# EasyEDA Pro project SCH.epro

# Schematic Schematic1
Board Name: Board1; Create Date: 2026-06-20; Page Name: P1; Project Name: DEVBOARD; Schematic Name: Schematic1; Update Date: 2026-06-20; Company: EasyEDA.com; Page Size: A4; Version: V1.0
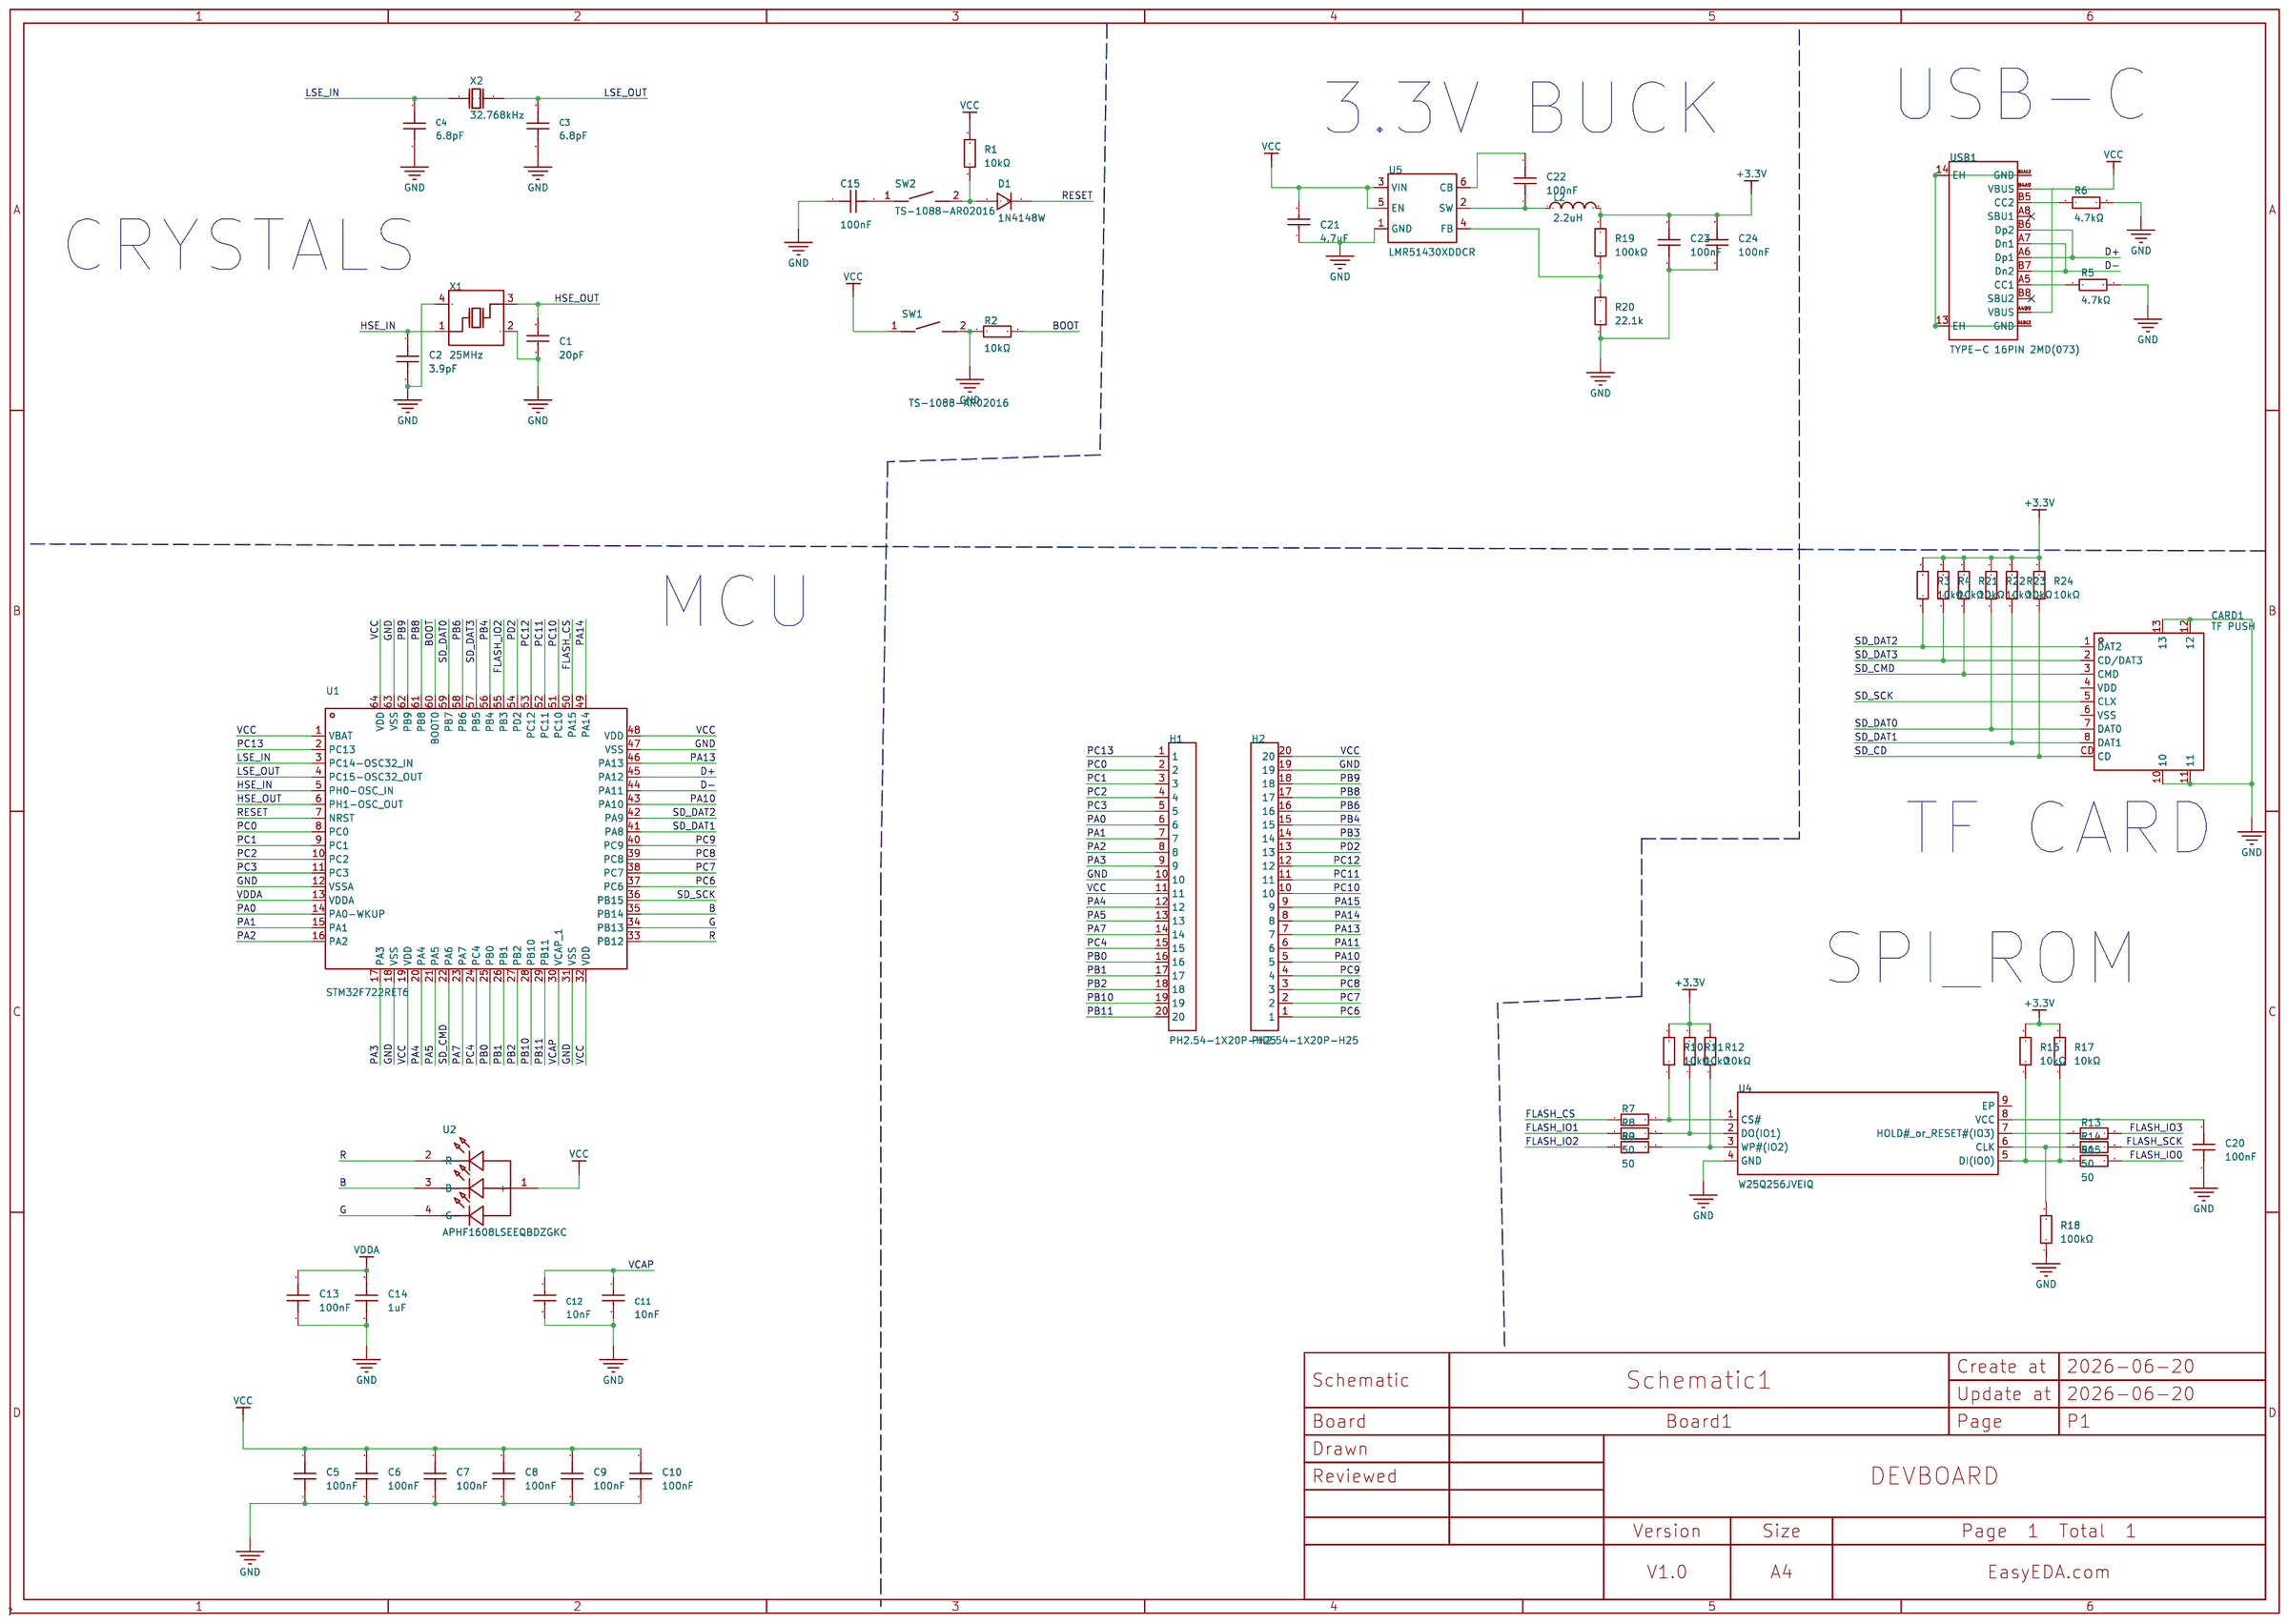
[diagram p0: schematic sheet]

## Parts
C1  20pF  [C0603]
C2  3.9pF  [C0603]
C3  6.8pF  [C0603]
C4  6.8pF  [C0603]
C5  100nF  [C0603]
C6  100nF  [C0603]
C7  100nF  [C0603]
C8  100nF  [C0603]
C9  100nF  [C0603]
C10  100nF  [C0603]
C11  10nF  [C0402]
C12  10nF  [C0402]
C13  100nF  [C0603]
C14  1uF  [C0603]
C15  100nF  [C0603]
C20  100nF  [C0603]
C21  4.7uF  [C0402]
C22  100nF  [C0603]
C23  100nF  [C0603]
C24  100nF  [C0603]
CARD1  TF PUSH  [TF-SMD_TF-PUSH]
D1  1N4148W  [SOD-123_L2.8-W1.8-LS3.7-RD]
H1  PH2.54-1X20P-H25  [HDR-TH_20P-P2.54-V-M_4]
H2  PH2.54-1X20P-H25  [HDR-TH_20P-P2.54-V-M_4]
L2  2.2uH  [IND-SMD_L4.0-W4.0_LQH44PN2R2MP0L]
R1  10kΩ  [R0603]
R2  10kΩ  [R0603]
R3  10kΩ  [R0603]
R4  10kΩ  [R0603]
R5  4.7kΩ  [R0603]
R6  4.7kΩ  [R0603]
R7  50  [R0603]
R8  50  [R0603]
R9  50  [R0603]
R10  10kΩ  [R0603]
R11  10kΩ  [R0603]
R12  10kΩ  [R0603]
R13  50  [R0603]
R14  50  [R0603]
R15  50  [R0603]
R16  10kΩ  [R0603]
R17  10kΩ  [R0603]
R18  100kΩ  [R0603]
R19  100kΩ  [R0603]
R20  22.1k  [R0603]
R21  10kΩ  [R0603]
R22  10kΩ  [R0603]
R23  10kΩ  [R0603]
R24  10kΩ  [R0603]
SW1  TS-1088-AR02016  [SW-SMD_L3.9-W3.0-P4.45]
SW2  TS-1088-AR02016  [SW-SMD_L3.9-W3.0-P4.45]
U1  STM32F722RET6  [LQFP-64_L10.0-W10.0-P0.50-LS12.0-BL]
U2  APHF1608LSEEQBDZGKC  [LED-SMD_4P-L1.6-W0.8_APHF1608LSEEQBDZGKC]
U4  W25Q256JVEIQ  [WSON-8_L8.0-W6.10-P1.27-BL-EP]
U5  LMR51430XDDCR  [SOT-23-6_L2.9-W1.6-P0.95-LS2.8-BL]
USB1  TYPE-C 16PIN 2MD(073)  [USB-C-SMD_TYPE-C-16PIN-2MD-073]
X1  25MHz  [CRYSTAL-SMD_4P-L3.2-W2.5-BL]
X2  32.768kHz  [OSC-SMD_2P-L1.6-W1.0]

## Library data of the parts
C1 = CL10C200JB8NNNC: Capacitance:20pF Tolerance:±5% Tolerance:±5% Voltage Rating:50V Temperature Coefficient:C0G; LCSC Part Name: 20pF ±5% 50V; Supplier Part: C1648; Manufacturer: SAMSUNG(三星); Supplier Footprint: 0603; JLCPCB Part Class: Basic Part; Datasheet: https://item.szlcsc.com/datasheet/CL10C200JB8NNNC/2000.html; Supplier: LCSC; Tolerance: ±5%; Voltage Rating: 50V; Temperature Coefficient: C0G
C2 = CAP_0603: Supplier Footprint: 0603
C3 C4 = 6.8pF: Capacitance: Voltage Rated: Temperature Coefficient:; LCSC Part Name: 6.8pF 50V; Supplier Part: C15720; Manufacturer: SAMSUNG(三星); Supplier Footprint: 0603; JLCPCB Part Class: Extended Part; Datasheet: https://atta.szlcsc.com/upload/public/pdf/source/20160218/1457707763339.pdf; Supplier: LCSC
C5-C10 C13 C15 C20 C22-C24 = CC0603KRX7R9BB104: Capacitance:100nF Tolerance:±10% Tolerance:±10% Voltage Rating:50V Temperature Coefficient:X7R; LCSC Part Name: 100nF ±10% 50V; Supplier Part: C14663; Manufacturer: YAGEO(国巨); Supplier Footprint: 0603; JLCPCB Part Class: Basic Part; Datasheet: https://item.szlcsc.com/datasheet/CC0603KRX7R9BB104/15331.html; Supplier: LCSC; Tolerance: ±10%; Voltage Rating: 50V; Temperature Coefficient: X7R
C11 C12 = 0402B103K500NT: Capacitance:10nF Tolerance:±10% Tolerance:±10% Voltage Rating:50V Temperature Coefficient:X7R; LCSC Part Name: 10nF ±10% 50V; Supplier Part: C1524; Manufacturer: FH(风华); Supplier Footprint: 0402; JLCPCB Part Class: Extended Part; Datasheet: https://item.szlcsc.com/datasheet/0402B103K500NT/1876.html; Supplier: LCSC; Tolerance: ±10%; Voltage Rating: 50V; Temperature Coefficient: X7R
C14 = CL10A105KB8NNNC: Capacitance:1uF Tolerance:±10% Tolerance:±10% Voltage Rating:50V Temperature Coefficient:X5R; LCSC Part Name: 1uF ±10% 50V; Supplier Part: C15849; Manufacturer: SAMSUNG(三星); Supplier Footprint: 0603; JLCPCB Part Class: Basic Part; Datasheet: https://item.szlcsc.com/datasheet/CL10A105KB8NNNC/16531.html; Supplier: LCSC; Tolerance: ±10%; Voltage Rating: 50V; Temperature Coefficient: X5R
C21 = GRM155R61A475KEAAD: Capacitance:4.7uF Tolerance:±10% Tolerance:±10% Voltage Rating:10V Temperature Coefficient:X5R; LCSC Part Name: 4.7uF ±10% 10V; Supplier Part: C77004; Manufacturer: muRata(村田); Supplier Footprint: 0402; JLCPCB Part Class: Extended Part; Datasheet: https://item.szlcsc.com/datasheet/GRM155R61A475KEAAD/78131.html; Supplier: LCSC; Tolerance: ±10%; Voltage Rating: 10V; Temperature Coefficient: X5R
CARD1 = TF PUSH: Card Connection Mode:Push-Push Card Type:MicroSD Card (TF Card) Connector Type:Connector and Ejector Additional Card Detection Pins:No Supplementary Features:- Height Above Board:2mm Operating Temperature:-25℃~+90℃ Operating Temperature:-25℃~+90℃; LCSC Part Name: 9P，自弹式TF卡座; Supplier Part: C393941; Manufacturer: SHOU HAN(首韩); Supplier Footprint: SMD; JLCPCB Part Class: Extended Part; Datasheet: https://item.szlcsc.com/datasheet/TF%2520PUSH/372553.html; Supplier: LCSC; Card Connection Mode: Push-Push; Card Type: MicroSD Card (TF Card); Connector Type: Connector and Ejector; Additional Card Detection Pins: No; Height Above Board: 2mm; Operating Temperature: -25℃~+90℃
D1 = 1N4148W_C176288: Diode Configuration:Independent Voltage - Forward(Vf@If):1.25V@150mA Voltage - DC Reverse(Vr):75V Current - Rectified:150mA Pd - Power Dissipation:400mW Reverse Leakage Current (Ir):2.5uA@75V Reverse Recovery Time (trr):4ns Operating Junction Temperature; Supplier Part: C176288; Manufacturer: SMC(桑德斯); Supplier Footprint: SOD-123; JLCPCB Part Class: Extended Part; Datasheet: https://item.szlcsc.com/datasheet/1N4148W/187678.html; Supplier: LCSC; Diode Configuration: Independent; Voltage - Forward(Vf@If): 1.25V@150mA; Voltage - DC Reverse(Vr): 75V; Current - Rectified: 150mA; Pd - Power Dissipation: 400mW; Reverse Leakage Current (Ir): 2.5uA@75V; Reverse Recovery Time (trr): 4ns; Operating Junction Temperature Range: -55℃~+125℃@(Tj); Non-Repetitive Peak Forward Surge Current: 2A
H1 H2 = PH2.54-1X20P-H25: Pin Structure:1x20P Pitch:2.54mm Row Spacing:- Circluar Pins/Square Pins:Pin Header Mounting Type:Through Hole Number of Rows:1 Number of Pins:20P Current Rating:3A Voltage Rating (Max):- Length of Mating Pin:6mm Insulation Height:2.5mm Length of End Conn; LCSC Part Name: 1x20P 间距:2.54mm 方针 直插; Supplier Part: C42431804; Manufacturer: JXTCONN(聚兴泰); Supplier Footprint: 插件,P=2.54mm; JLCPCB Part Class: Extended Part; Datasheet: https://item.szlcsc.com/datasheet/PH2.54-1X20P-H25/44458934.html; Supplier: LCSC; Pin Structure: 1x20P; Pitch: 2.54mm; Circluar Pins/Square Pins: Pin Header; Mounting Type: Through Hole; Number of Rows: 1; Number of Pins: 20P; Current Rating: 3A; Length of Mating Pin: 6mm; Insulation Height: 2.5mm; Length of End Connection Pin: 3mm; Contact Material: Brass; Contact Plating: Gold; Operating Temperature: -40℃~+105℃; Color: Black
L2 = SMNR4020-2.2UH: Inductance:2.2uH Tolerance:±20% Tolerance:±20% Current Rating:3.4A Current - Saturation(Isat):3.4A DC Resistance(DCR):46mΩ; LCSC Part Name: 2.2uH ±20% 3.4A; Supplier Part: C135262; Manufacturer: SXN(顺翔诺); Supplier Footprint: SMD,4x4mm; JLCPCB Part Class: Extended Part; Datasheet: https://item.szlcsc.com/datasheet/SMNR4020-2.2UH/146573.html; Supplier: LCSC; Tolerance: ±20%; Current Rating: 3.4A; Current - Saturation(Isat): 3.4A; DC Resistance(DCR): 46mΩ
R1-R4 R10-R12 R16 R17 R21-R24 = RC0603FR-0710KL: Type:Thick Film Resistor Resistance:10kΩ Tolerance:±1% Tolerance:±1% Power(Watts):100mW Voltage-Supply(Max):75V Temperature Coefficient:±100ppm/℃ Temperature Coefficient:±100ppm/℃ Operating Temperature:-55℃~+155℃ Operating Temperature:-55℃~+155℃; LCSC Part Name: 厚膜电阻 10kΩ ±1% 100mW; Supplier Part: C98220; Manufacturer: YAGEO(国巨); Supplier Footprint: 0603; JLCPCB Part Class: Extended Part; Datasheet: https://item.szlcsc.com/datasheet/RC0603FR-0710KL/99429.html; Supplier: LCSC; Type: Thick Film Resistor; Tolerance: ±1%; Power(Watts): 100mW; Voltage-Supply(Max): 75V; Temperature Coefficient: ±100ppm/℃; Operating Temperature: -55℃~+155℃
R5 R6 = 0603WAF4701T5E: Type:Thick Film Resistor Resistance:4.7kΩ Tolerance:±1% Tolerance:±1% Power(Watts):100mW Voltage-Supply(Max):75V Temperature Coefficient:±100ppm/℃ Temperature Coefficient:±100ppm/℃ Operating Temperature:-55℃~+155℃ Operating Temperature:-55℃~+155℃; LCSC Part Name: 4.7kΩ ±1% 100mW 厚膜电阻; Supplier Part: C23162; Manufacturer: UNI-ROYAL(厚声); Supplier Footprint: 0603; JLCPCB Part Class: Basic Part; Datasheet: https://item.szlcsc.com/datasheet/0603WAF4701T5E/23889.html; Supplier: LCSC; Type: Thick Film Resistor; Tolerance: ±1%; Power(Watts): 100mW; Voltage-Supply(Max): 75V; Temperature Coefficient: ±100ppm/℃; Operating Temperature: -55℃~+155℃
R7-R9 R13-R15 = Res_0603: Supplier Footprint: 0603
R18 R19 = 0603WAF1003T5E: Type:Thick Film Resistor Resistance:100kΩ Tolerance:±1% Tolerance:±1% Power(Watts):100mW Voltage-Supply(Max):75V Temperature Coefficient:±100ppm/℃ Temperature Coefficient:±100ppm/℃ Operating Temperature:-55℃~+155℃ Operating Temperature:-55℃~+155℃; LCSC Part Name: 100kΩ ±1% 100mW 厚膜电阻; Supplier Part: C25803; Manufacturer: UNI-ROYAL(厚声); Supplier Footprint: 0603; JLCPCB Part Class: Basic Part; Datasheet: https://item.szlcsc.com/datasheet/0603WAF1003T5E/26546.html; Supplier: LCSC; Type: Thick Film Resistor; Tolerance: ±1%; Power(Watts): 100mW; Voltage-Supply(Max): 75V; Temperature Coefficient: ±100ppm/℃; Operating Temperature: -55℃~+155℃
R20 = Res_0603: Supplier Footprint: 0603; Supplier: LCSC; Supplier Part: C269476; Manufacturer: Tyohm(幸亚电阻); Manufacturer Part: RMC060322.1K1%N; JLCPCB Part Class: Extended Part; LCSC Part Name: 厚膜电阻 22.1kΩ ±1% 100mW; Datasheet: https://item.szlcsc.com/datasheet/RMC060322.1K1%2525N/258916.html; Type: Thick Film Resistor; Tolerance: ±1%; Power(Watts): 100mW; Voltage-Supply(Max): 50V; Temperature Coefficient: ±100ppm/℃; Operating Temperature: -55℃~+155℃
SW1 SW2 = TS-1088-AR02016: Circuit:SPST Actuator Style:Round Button Operating Force:1.6N Mounting Type:Surface Mount,Vertical Length:4mm Width:3mm Switch Height:2mm with Bracket:Without Bracket Contact Current:50mA Voltage Rating:12V Actuator/Cap Color:Black Termination Style:SMD(S; LCSC Part Name: 4*3*2mm 立贴 轻触开关; Supplier Part: C720477; Manufacturer: XUNPU(讯普); Supplier Footprint: SMD,4x3mm; JLCPCB Part Class: Basic Part; Datasheet: https://item.szlcsc.com/datasheet/TS-1088-AR02016/763484.html; Supplier: LCSC; Circuit: SPST; Actuator Style: Round Button; Operating Force: 1.6N; Mounting Type: Surface Mount,Vertical; Length: 4mm; Width: 3mm; Switch Height: 2mm; with Bracket: Without Bracket; Contact Current: 50mA; Voltage Rating: 12V; Actuator/Cap Color: Black; Termination Style: SMD(SMT) Tab; Life: 100,000 Cycles; Operating Temperature: -30℃~+80℃
U1 = STM32F722RET6: CPU Core:ARM Cortex-M Series CPU Maximum Speed:216MHz Program Storage Size:512KB Program Memory Type:FLASH Number of I/O:50 ADC (Bit):12bit DAC (Bit):12bit Voltage - Supply:1.7V~3.6V Voltage - Supply:1.7V~3.6V Applications:-; LCSC Part Name: 带DSP和FPU的高性能ARM Cortex-M7 MCU，具有512 KB Flash、216 MHz CPU、ART加速器、一级缓存和SDRAM; Supplier Part: C118207; Manufacturer: ST(意法半导体); Supplier Footprint: LQFP-64(10x10); JLCPCB Part Class: Extended Part; Datasheet: https://item.szlcsc.com/datasheet/STM32F722RET6/119471.html; Supplier: LCSC; CPU Core: ARM Cortex-M Series; CPU Maximum Speed: 216MHz; Program Storage Size: 512KB; Program Memory Type: FLASH; Number of I/O: 50; ADC (Bit): 12bit; DAC (Bit): 12bit; Voltage - Supply: 1.7V~3.6V
U2 = APHF1608LSEEQBDZGKC: Diode Configuration:Common Anode Wavelength - Dominant:B:465nm；G:525nm；R:621nm Peak Wavelength:B:460nm；R:630nm；G:515nm Luminous Intensity:G:90mcd；B:10mcd；R:15mcd Viewing Angle:140° Lens Color:Water Clear Forward Current:R:30mA；B:20mA；G:20mA Forward Voltag; LCSC Part Name: 1.6 x 0.8 mm全彩贴片式LED; Supplier Part: C3019171; Manufacturer: Kingbright; Supplier Footprint: SMD-4P,1.6x0.8mm; JLCPCB Part Class: Extended Part; Datasheet: https://item.szlcsc.com/datasheet/APHF1608LSEEQBDZGKC/3535847.html; Supplier: LCSC; Diode Configuration: Common Anode; Wavelength - Dominant: B:465nm；G:525nm；R:621nm; Peak Wavelength: B:460nm；R:630nm；G:515nm; Luminous Intensity: G:90mcd；B:10mcd；R:15mcd; Viewing Angle: 140°; Lens Color: Water Clear; Forward Current: R:30mA；B:20mA；G:20mA; Forward Voltage(Vf): G:2.65V~3.1V；B:2.65V~3.1V；R:1.8V~2.1V; Antistatic Capacity: R:3000V；B:250V；G:450V; Power(Watts): B:80mW；G:82mW；R:75mW; Operating Temperature: -40℃~+85℃; Length: 1.6mm; Width: 0.8mm; Height: 0.5mm
U4 = W25Q256JVEIQ_C97522: Interface:SPI Memory Size:256Mbit Clock Frequency:133MHz Voltage - Supply:2.7V~3.6V Voltage - Supply:2.7V~3.6V Program / Erase Cycles:100,000 Cycles Page Programming Time (Tpp):700us Block Erase Time(tBE):120ms@(32KB) Data Retention - TDR (Year):20 Years; LCSC Part Name: 具备双/四SPI接口的3V、256Mbit 串行闪存; Supplier Part: C97522; Manufacturer: Winbond(华邦); Supplier Footprint: WSON-8-EP(6x8); JLCPCB Part Class: Extended Part; Datasheet: https://item.szlcsc.com/datasheet/W25Q256JVEIQ/98730.html; Supplier: LCSC; Interface: SPI; Memory Size: 256Mbit; Clock Frequency: 133MHz; Voltage - Supply: 2.7V~3.6V; Program / Erase Cycles: 100,000 Cycles; Page Programming Time (Tpp): 700us; Block Erase Time(tBE): 120ms@(32KB); Data Retention - TDR (Year): 20 Years; Operating Temperature: -40℃~+85℃
U5 = LMR51430XDDCR: Function:Step-down type Voltage - Supply:4.5V~36V Voltage - Supply:4.5V~36V Output Voltage:600mV~34.2V Output Voltage:600mV~34.2V Output Current:3A Frequency - Switching:500kHz Frequency - Switching:500kHz Operating Temperature:-40℃~+150℃@(TJ) Operating T; LCSC Part Name: 降压型 3A 4.5V~36V; Supplier Part: C5185863; Manufacturer: TI(德州仪器); Supplier Footprint: SOT-23-6; JLCPCB Part Class: Extended Part; Datasheet: https://item.szlcsc.com/datasheet/LMR51430XDDCR/5856347.html; Supplier: LCSC; Function: Step-down type; Voltage - Supply: 4.5V~36V; Output Voltage: 600mV~34.2V; Output Current: 3A; Frequency - Switching: 500kHz; Operating Temperature: -40℃~+150℃@(TJ); Synchronous Rectifier: Yes; Number of Outputs: 1; Topology: Buck; Quiescent Current: 40uA; Switch tube (built-in/external): Built-in; Output Type: Adjustable; Features: Light load efficient mode；Cycle-by-cycle current limiting；Overcurrent Protection；Hiccup current limiting
USB1 = TYPE-C 16PIN 2MD(073): Connector Type:Type-C Protocol Standard:- Gender:Female Mounting Type:Surface Mount, Right Angle Number of Contacts:16P Number of Ports:1 Current Rating-Power:3A Voltage Rating:5V Connect-Disconnect Life:10,000 Cycles Supplementary Features:- Center Heigh; LCSC Part Name: Type-C 母 卧贴; Supplier Part: C2765186; Manufacturer: SHOU HAN(首韩); Supplier Footprint: SMD; JLCPCB Part Class: Extended Part; Datasheet: https://item.szlcsc.com/datasheet/TYPE-C%252016PIN%25202MD(073)/2901843.html; Supplier: LCSC; Connector Type: Type-C; Gender: Female; Mounting Type: Surface Mount, Right Angle; Number of Contacts: 16P; Number of Ports: 1; Current Rating-Power: 3A; Voltage Rating: 5V; Connect-Disconnect Life: 10,000 Cycles; Detection color: Black; Operating Temperature: -25℃~+85℃
X1 = X322525MOB4SI: Type:Crystal Oscillator Frequency:25MHz Normal temperature Frequency Tolerance:±10ppm Normal temperature Frequency Tolerance:±10ppm Load Capacitance:12pF Frequency Stability:±20ppm Frequency Stability:±20ppm Operating Temperature:-40℃~+85℃ Operating Tempe; LCSC Part Name: YSX321SL 25MHZ 4P 3225 12PF ±10PPM -40~85℃ (±20PPM); Supplier Part: C9006; Manufacturer: YXC(扬兴晶振); Supplier Footprint: SMD3225-4P; JLCPCB Part Class: Basic Part; Datasheet: https://item.szlcsc.com/datasheet/X322525MOB4SI/9526.html; Supplier: LCSC; Type: Crystal Oscillator; Normal temperature Frequency Tolerance: ±10ppm; Load Capacitance: 12pF; Frequency Stability: ±20ppm; Operating Temperature: -40℃~+85℃
X2 = ABS05-32.768kHz-T: Type:- Frequency:32.768kHz Normal temperature Frequency Tolerance:±20ppm Normal temperature Frequency Tolerance:±20ppm Load Capacitance:12.5pF Frequency Stability:- Frequency Stability:- Equivalent Series Resistance(ESR):90kΩ Operating Temperature:-40℃~+8; LCSC Part Name: 32.768kHz ±20ppm 12.5pF; Supplier Part: C179633; Manufacturer: ABRACON; Supplier Footprint: SMD1610-2P; JLCPCB Part Class: Extended Part; Datasheet: https://item.szlcsc.com/datasheet/ABS05-32.768kHz-T/191028.html; Supplier: LCSC; Normal temperature Frequency Tolerance: ±20ppm; Load Capacitance: 12.5pF; Equivalent Series Resistance(ESR): 90kΩ; Operating Temperature: -40℃~+85℃

## Nets
+3.3V: C23.2 C24.2 L2.2 R3.2 R4.2 R10.2 R11.2 R12.2 R16.2 R17.2 R19.2 R21.2 R22.2 R23.2 R24.2
GND: C1.1 C2.2 C3.2 C4.2 C5.1 C6.1 C7.1 C8.1 C9.1 C10.1 C11.1 C12.1 C13.1 C14.1 C15.1 C20.1 C21.1 C23.1 C24.1 CARD1.10 CARD1.11 CARD1.12 CARD1.13 H1.10 H2.19 R2.2 R5.2 R6.2 R18.1 R20.1 SW1.2 U1.12(VSSA) U1.18(VSS) U1.31(VSS) U1.47(VSS) U1.63(VSS) U4.4(GND) U5.1(GND) X1.2(GND) X1.4(GND)
VCC: C5.2 C6.2 C7.2 C8.2 C9.2 C10.2 C21.2 H1.11 H2.20 R1.2 SW1.1 U1.1(VBAT) U1.19(VDD) U1.32(VDD) U1.48(VDD) U1.64(VDD) U2.1(+) U5.3(VIN) U5.5(EN)
VDDA: C13.2 C14.2 U1.13(VDDA)
B: U1.35(PB14) U2.3(B-)
BOOT: R2.1 U1.60(BOOT0)
D+: U1.45(PA12) USB1.A6(Dp1) USB1.B6(Dp2)
D-: U1.44(PA11) USB1.A7(Dn1) USB1.B7(Dn2)
FLASH_CS: R7.1 U1.50(PA15)
FLASH_IO0: R15.2
FLASH_IO1: R8.1
FLASH_IO2: R9.1 U1.55(PB3)
FLASH_IO3: R13.2
FLASH_SCK: R14.2
G: U1.34(PB13) U2.4(G-)
HSE_IN: C2.1 U1.5(PH0-OSC_IN) X1.1(OSC1)
HSE_OUT: C1.2 U1.6(PH1-OSC_OUT) X1.3(OSC2)
LSE_IN: C4.1 U1.3(PC14-OSC32_IN) X2.1(OSC1)
LSE_OUT: C3.1 U1.4(PC15-OSC32_OUT) X2.2(OSC2)
PA0: H1.6 U1.14(PA0-WKUP)
PA1: H1.7 U1.15(PA1)
PA2: H1.8 U1.16(PA2)
PA3: H1.9 U1.17(PA3)
PA4: H1.12 U1.20(PA4)
PA5: H1.13 U1.21(PA5)
PA7: H1.14 U1.23(PA7)
PA10: H2.5 U1.43(PA10)
PA11: H2.6
PA13: H2.7 U1.46(PA13)
PA14: H2.8 U1.49(PA14)
PA15: H2.9
PB0: H1.16 U1.25(PB0)
PB1: H1.17 U1.26(PB1)
PB2: H1.18 U1.27(PB2)
PB3: H2.14
PB4: H2.15 U1.56(PB4)
PB6: H2.16 U1.58(PB6)
PB8: H2.17 U1.61(PB8)
PB9: H2.18 U1.62(PB9)
PB10: H1.19 U1.28(PB10)
PB11: H1.20 U1.29(PB11)
PC0: H1.2 U1.8(PC0)
PC1: H1.3 U1.9(PC1)
PC2: H1.4 U1.10(PC2)
PC3: H1.5 U1.11(PC3)
PC4: H1.15 U1.24(PC4)
PC6: H2.1 U1.37(PC6)
PC7: H2.2 U1.38(PC7)
PC8: H2.3 U1.39(PC8)
PC9: H2.4 U1.40(PC9)
PC10: H2.10 U1.51(PC10)
PC11: H2.11 U1.52(PC11)
PC12: H2.12 U1.53(PC12)
PC13: H1.1 U1.2(PC13)
PD2: H2.13 U1.54(PD2)
R: U1.33(PB12) U2.2(R-)
RESET: D1.1(C) U1.7(NRST)
SD_CD: CARD1.CD R24.1
SD_CMD: CARD1.3(CMD) R21.1 U1.22(PA6)
SD_DAT0: CARD1.7(DAT0) R22.1 U1.59(PB7)
SD_DAT1: CARD1.8(DAT1) R23.1 U1.41(PA8)
SD_DAT2: CARD1.1(DAT2) R3.1 U1.42(PA9)
SD_DAT3: CARD1.2(CD/DAT3) R4.1 U1.57(PB5)
SD_SCK: CARD1.5(CLX) U1.36(PB15)
VCAP: C11.2 C12.2 U1.30(VCAP_1)
Net-(C15-2): C15.2 SW2.1
Net-(C20-2): C20.2 U4.8(VCC)
Net-(C22-1): C22.1 L2.1 U5.2(SW)
Net-(C22-2): C22.2 U5.6(CB)
Net-(D1-2): D1.2(A) R1.1 SW2.2
Net-(R5-1): R5.1 USB1.A5(CC1)
Net-(R6-1): R6.1 USB1.B5(CC2)
Net-(R7-2): R7.2 R10.1 U4.1(CS#)
Net-(R8-2): R8.2 R11.1 U4.2(DO(IO1))
Net-(R9-2): R9.2 R12.1 U4.3(WP#(IO2))
Net-(R13-1): R13.1 U4.7(HOLD# or RESET#(IO3))
Net-(R14-1): R14.1 R18.2 U4.6(CLK)
Net-(R15-1): R15.1 R16.1 R17.1 U4.5(DI(IO0))
Net-(R19-1): R19.1 R20.2 U5.4(FB)
Net-(USB1-13): USB1.13(EH) USB1.14(EH) USB1.A1B12(GND) USB1.B1A12(GND)
Net-(USB1-A4B9): USB1.A4B9(VBUS) USB1.B4A9(VBUS)

Not connected (* = marked no-connect by the designer): CARD1 4(VDD) 6(VSS); U4 9(EP); USB1 A8(SBU1)* B8(SBU2)*

## Notes on the sheet
- USB-C
- 3.3V BUCK
- CRYSTALS
- MCU
- TF CARD
- SPI_ROM
